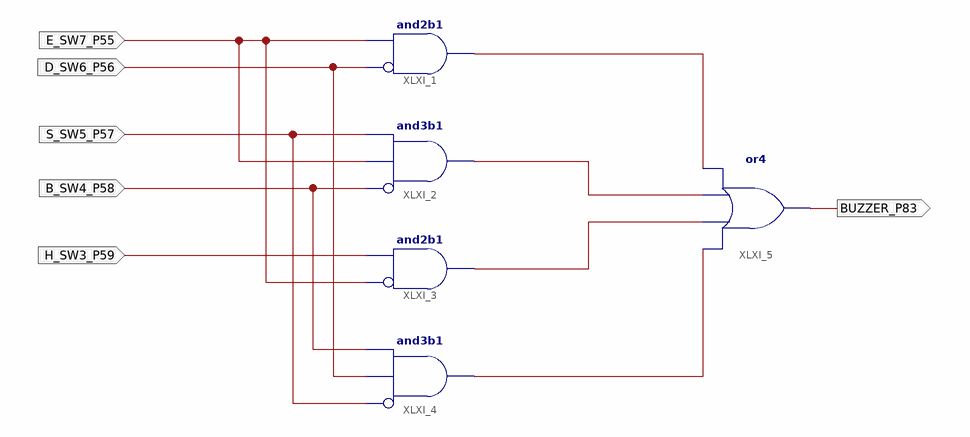
[diagram p0: schematic sheet 1]
// Xilinx ISE schematic MainLogic.sch (spartan6) as structural Verilog: 5 symbols, 6 ports
module MainLogic (
  input  S_SW5_P57,
  input  D_SW6_P56,
  input  E_SW7_P55,
  input  B_SW4_P58,
  input  H_SW3_P59,
  output BUZZER_P83
);

  wire XLXN_1, XLXN_2, XLXN_3, XLXN_4;

  and XLXI_1 (XLXN_1, ~D_SW6_P56, E_SW7_P55);  // and2b1
  and XLXI_2 (XLXN_2, ~B_SW4_P58, E_SW7_P55, S_SW5_P57);  // and3b1
  and XLXI_3 (XLXN_3, ~E_SW7_P55, H_SW3_P59);  // and2b1
  and XLXI_4 (XLXN_4, ~S_SW5_P57, D_SW6_P56, B_SW4_P58);  // and3b1
  or XLXI_5 (BUZZER_P83, XLXN_4, XLXN_3, XLXN_2, XLXN_1);
endmodule
